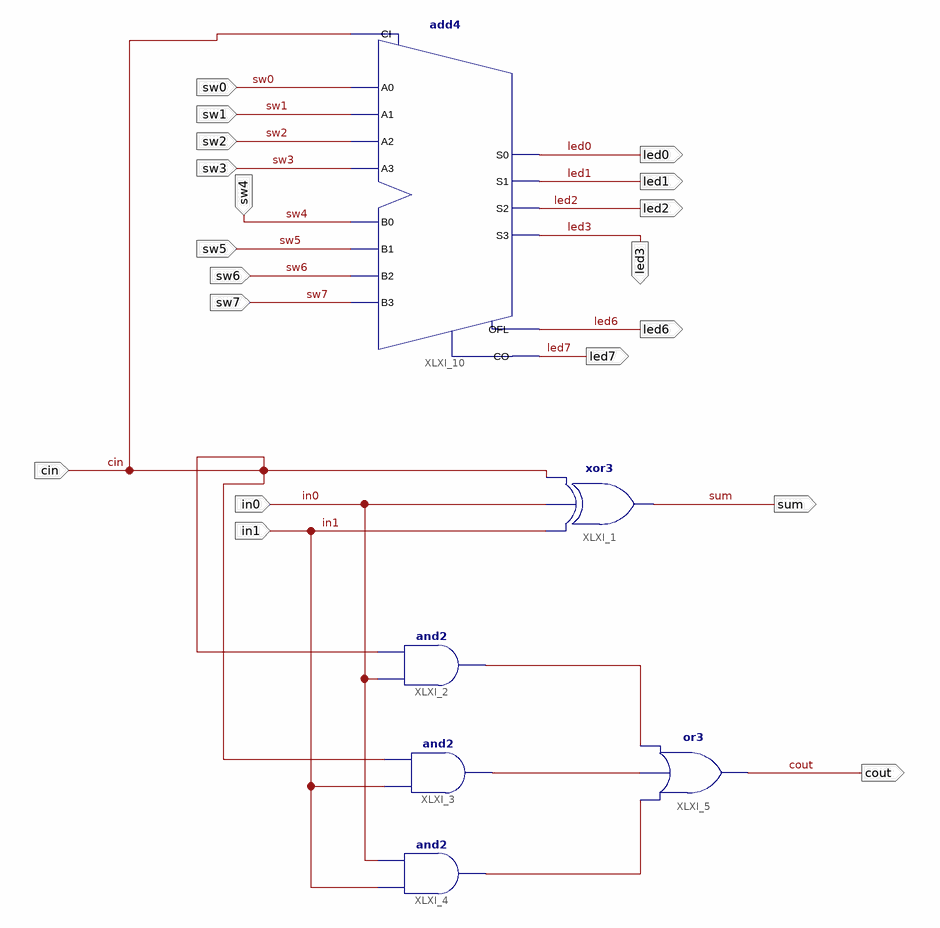
[diagram p0: schematic sheet 1]
// Xilinx ISE schematic schematic.sch (spartan3e) as structural Verilog: 6 symbols, 19 ports
module schematic (
  input  in0,
  input  in1,
  input  sw0,
  input  sw1,
  input  sw2,
  input  sw3,
  input  sw4,
  input  sw5,
  input  sw6,
  input  sw7,
  input  cin,
  output sum,
  output cout,
  output led0,
  output led1,
  output led2,
  output led3,
  output led7,
  output led6
);

  wire XLXN_8, XLXN_9, XLXN_11;

  add4 XLXI_10 (
    .A0(sw0), .A1(sw1), .A2(sw2), .A3(sw3), .B0(sw4), .B1(sw5), .B2(sw6), .B3(sw7), .CI(cin), .CO(led7),
    .OFL(led6), .S0(led0), .S1(led1), .S2(led2), .S3(led3));
  xor XLXI_1 (sum, in1, in0, cin);
  and XLXI_2 (XLXN_8, in0, cin);
  and XLXI_3 (XLXN_9, in1, cin);
  and XLXI_4 (XLXN_11, in1, in0);
  or XLXI_5 (cout, XLXN_11, XLXN_9, XLXN_8);
endmodule
